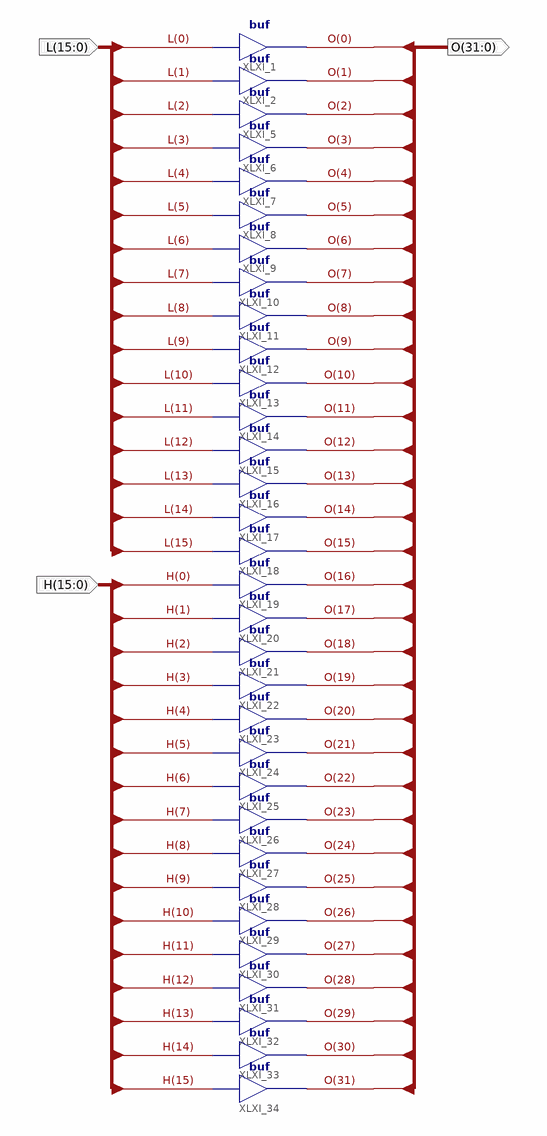
[diagram p0: schematic sheet 1]
// Xilinx ISE schematic bus_splicer.sch (spartan6) as structural Verilog: 32 symbols, 3 ports
module bus_splicer (
  input  [15:0] L,
  input  [15:0] H,
  output [31:0] O
);

  buf XLXI_1 (O[0], L[0]);
  buf XLXI_2 (O[1], L[1]);
  buf XLXI_5 (O[2], L[2]);
  buf XLXI_6 (O[3], L[3]);
  buf XLXI_7 (O[4], L[4]);
  buf XLXI_8 (O[5], L[5]);
  buf XLXI_9 (O[6], L[6]);
  buf XLXI_10 (O[7], L[7]);
  buf XLXI_11 (O[8], L[8]);
  buf XLXI_12 (O[9], L[9]);
  buf XLXI_13 (O[10], L[10]);
  buf XLXI_14 (O[11], L[11]);
  buf XLXI_15 (O[12], L[12]);
  buf XLXI_16 (O[13], L[13]);
  buf XLXI_17 (O[14], L[14]);
  buf XLXI_18 (O[15], L[15]);
  buf XLXI_19 (O[16], H[0]);
  buf XLXI_20 (O[17], H[1]);
  buf XLXI_21 (O[18], H[2]);
  buf XLXI_22 (O[19], H[3]);
  buf XLXI_23 (O[20], H[4]);
  buf XLXI_24 (O[21], H[5]);
  buf XLXI_25 (O[22], H[6]);
  buf XLXI_26 (O[23], H[7]);
  buf XLXI_27 (O[24], H[8]);
  buf XLXI_28 (O[25], H[9]);
  buf XLXI_29 (O[26], H[10]);
  buf XLXI_30 (O[27], H[11]);
  buf XLXI_31 (O[28], H[12]);
  buf XLXI_32 (O[29], H[13]);
  buf XLXI_33 (O[30], H[14]);
  buf XLXI_34 (O[31], H[15]);
endmodule
